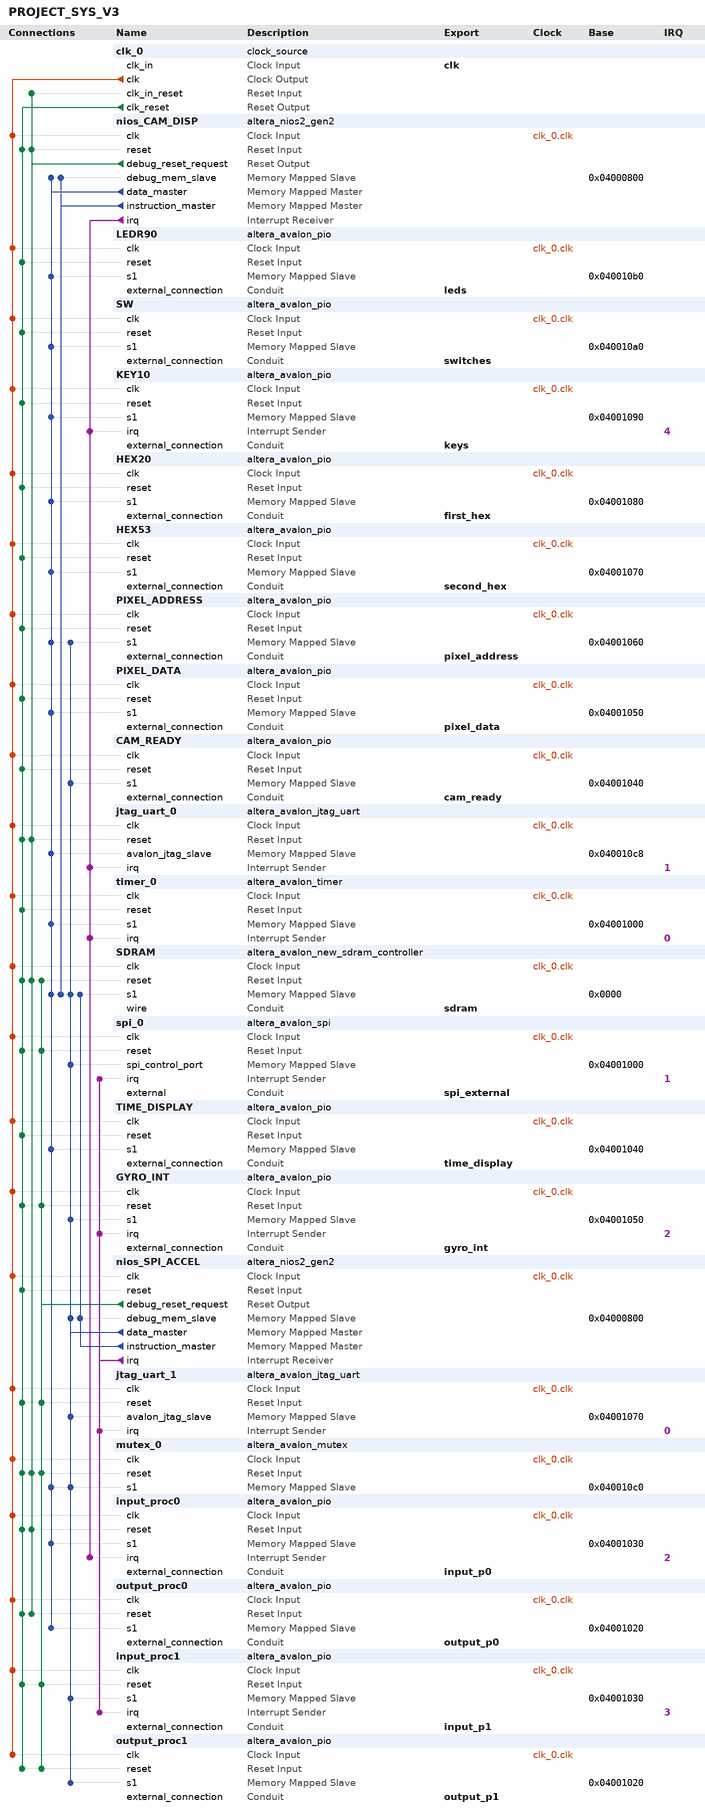
[diagram p0: system contents]
# Platform Designer (Qsys) system PROJECT_SYS_V3, MAX 10 10M50DAF484C7G
# Parameters at their usual value, and those the tool derives, are not listed.
package require -exact qsys 18.1
create_system PROJECT_SYS_V3
set_project_property DEVICE_FAMILY {MAX 10}
set_project_property DEVICE 10M50DAF484C7G

add_instance clk_0 clock_source 18.1
set_instance_parameter_value clk_0 clockFrequency 50000000

add_instance nios_CAM_DISP altera_nios2_gen2 18.1
set_instance_parameter_value nios_CAM_DISP dcache_size 2048
set_instance_parameter_value nios_CAM_DISP exceptionSlave SDRAM.s1
set_instance_parameter_value nios_CAM_DISP icache_size 4096
set_instance_parameter_value nios_CAM_DISP impl Fast
set_instance_parameter_value nios_CAM_DISP resetSlave SDRAM.s1

add_instance LEDR90 altera_avalon_pio 18.1
set_instance_parameter_value LEDR90 direction Output
set_instance_parameter_value LEDR90 width 10

add_instance SW altera_avalon_pio 18.1
set_instance_parameter_value SW direction Input
set_instance_parameter_value SW width 10

add_instance KEY10 altera_avalon_pio 18.1
set_instance_parameter_value KEY10 captureEdge true
set_instance_parameter_value KEY10 direction Input
set_instance_parameter_value KEY10 generateIRQ true
set_instance_parameter_value KEY10 irqType EDGE
set_instance_parameter_value KEY10 width 2

add_instance HEX20 altera_avalon_pio 18.1
set_instance_parameter_value HEX20 direction Output
set_instance_parameter_value HEX20 width 24

add_instance HEX53 altera_avalon_pio 18.1
set_instance_parameter_value HEX53 direction Output
set_instance_parameter_value HEX53 width 24

add_instance PIXEL_ADDRESS altera_avalon_pio 18.1
set_instance_parameter_value PIXEL_ADDRESS direction Output
set_instance_parameter_value PIXEL_ADDRESS width 17

add_instance PIXEL_DATA altera_avalon_pio 18.1
set_instance_parameter_value PIXEL_DATA direction Output
set_instance_parameter_value PIXEL_DATA width 4

add_instance CAM_READY altera_avalon_pio 18.1
set_instance_parameter_value CAM_READY direction Input
set_instance_parameter_value CAM_READY width 1

add_instance jtag_uart_0 altera_avalon_jtag_uart 18.1
set_instance_parameter_value jtag_uart_0 readBufferDepth 256
set_instance_parameter_value jtag_uart_0 simInteractiveOptions NO_INTERACTIVE_WINDOWS
set_instance_parameter_value jtag_uart_0 writeBufferDepth 256

add_instance timer_0 altera_avalon_timer 18.1
set_instance_parameter_value timer_0 period 1
set_instance_parameter_value timer_0 periodUnits MSEC

add_instance SDRAM altera_avalon_new_sdram_controller 18.1
set_instance_parameter_value SDRAM TAC 5.5
set_instance_parameter_value SDRAM TRCD 20.0
set_instance_parameter_value SDRAM TRP 20.0
set_instance_parameter_value SDRAM casLatency 3
set_instance_parameter_value SDRAM columnWidth 10
set_instance_parameter_value SDRAM dataWidth 16
set_instance_parameter_value SDRAM generateSimulationModel false
set_instance_parameter_value SDRAM model single_Micron_MT48LC4M32B2_7_chip
set_instance_parameter_value SDRAM numberOfBanks 4
set_instance_parameter_value SDRAM numberOfChipSelects 1
set_instance_parameter_value SDRAM powerUpDelay 100.0
set_instance_parameter_value SDRAM refreshPeriod 15.625
set_instance_parameter_value SDRAM rowWidth 13

add_instance spi_0 altera_avalon_spi 18.1
set_instance_parameter_value spi_0 clockPhase 1
set_instance_parameter_value spi_0 clockPolarity 1
set_instance_parameter_value spi_0 dataWidth 8
set_instance_parameter_value spi_0 masterSPI true
set_instance_parameter_value spi_0 numberOfSlaves 2
set_instance_parameter_value spi_0 targetClockRate 5000000

add_instance TIME_DISPLAY altera_avalon_pio 18.1
set_instance_parameter_value TIME_DISPLAY direction Input
set_instance_parameter_value TIME_DISPLAY width 32

add_instance GYRO_INT altera_avalon_pio 18.1
set_instance_parameter_value GYRO_INT captureEdge true
set_instance_parameter_value GYRO_INT direction Input
set_instance_parameter_value GYRO_INT generateIRQ true
set_instance_parameter_value GYRO_INT irqType EDGE
set_instance_parameter_value GYRO_INT width 1

add_instance nios_SPI_ACCEL altera_nios2_gen2 18.1
set_instance_parameter_value nios_SPI_ACCEL cpuID 1
set_instance_parameter_value nios_SPI_ACCEL dcache_size 2048
set_instance_parameter_value nios_SPI_ACCEL exceptionSlave SDRAM.s1
set_instance_parameter_value nios_SPI_ACCEL icache_size 4096
set_instance_parameter_value nios_SPI_ACCEL impl Fast
set_instance_parameter_value nios_SPI_ACCEL resetSlave SDRAM.s1

add_instance jtag_uart_1 altera_avalon_jtag_uart 18.1
set_instance_parameter_value jtag_uart_1 simInteractiveOptions NO_INTERACTIVE_WINDOWS

add_instance mutex_0 altera_avalon_mutex 18.1

add_instance input_proc0 altera_avalon_pio 18.1
set_instance_parameter_value input_proc0 bitClearingEdgeCapReg true
set_instance_parameter_value input_proc0 captureEdge true
set_instance_parameter_value input_proc0 direction Input
set_instance_parameter_value input_proc0 generateIRQ true
set_instance_parameter_value input_proc0 irqType EDGE
set_instance_parameter_value input_proc0 width 1

add_instance output_proc0 altera_avalon_pio 18.1
set_instance_parameter_value output_proc0 direction Output
set_instance_parameter_value output_proc0 width 1

add_instance input_proc1 altera_avalon_pio 18.1
set_instance_parameter_value input_proc1 bitClearingEdgeCapReg true
set_instance_parameter_value input_proc1 captureEdge true
set_instance_parameter_value input_proc1 direction Input
set_instance_parameter_value input_proc1 generateIRQ true
set_instance_parameter_value input_proc1 irqType EDGE
set_instance_parameter_value input_proc1 width 1

add_instance output_proc1 altera_avalon_pio 18.1
set_instance_parameter_value output_proc1 direction Output
set_instance_parameter_value output_proc1 width 1

# connections
add_connection clk_0.clk CAM_READY.clk clock
add_connection clk_0.clk GYRO_INT.clk clock
add_connection clk_0.clk HEX20.clk clock
add_connection clk_0.clk HEX53.clk clock
add_connection clk_0.clk input_proc0.clk clock
add_connection clk_0.clk input_proc1.clk clock
add_connection clk_0.clk jtag_uart_0.clk clock
add_connection clk_0.clk jtag_uart_1.clk clock
add_connection clk_0.clk KEY10.clk clock
add_connection clk_0.clk LEDR90.clk clock
add_connection clk_0.clk mutex_0.clk clock
add_connection clk_0.clk nios_CAM_DISP.clk clock
add_connection clk_0.clk nios_SPI_ACCEL.clk clock
add_connection clk_0.clk output_proc0.clk clock
add_connection clk_0.clk output_proc1.clk clock
add_connection clk_0.clk PIXEL_ADDRESS.clk clock
add_connection clk_0.clk PIXEL_DATA.clk clock
add_connection clk_0.clk SDRAM.clk clock
add_connection clk_0.clk spi_0.clk clock
add_connection clk_0.clk SW.clk clock
add_connection clk_0.clk TIME_DISPLAY.clk clock
add_connection clk_0.clk timer_0.clk clock
add_connection clk_0.clk_reset CAM_READY.reset reset
add_connection clk_0.clk_reset GYRO_INT.reset reset
add_connection clk_0.clk_reset HEX20.reset reset
add_connection clk_0.clk_reset HEX53.reset reset
add_connection clk_0.clk_reset input_proc0.reset reset
add_connection clk_0.clk_reset input_proc1.reset reset
add_connection clk_0.clk_reset jtag_uart_0.reset reset
add_connection clk_0.clk_reset jtag_uart_1.reset reset
add_connection clk_0.clk_reset KEY10.reset reset
add_connection clk_0.clk_reset LEDR90.reset reset
add_connection clk_0.clk_reset mutex_0.reset reset
add_connection clk_0.clk_reset nios_CAM_DISP.reset reset
add_connection clk_0.clk_reset nios_SPI_ACCEL.reset reset
add_connection clk_0.clk_reset output_proc0.reset reset
add_connection clk_0.clk_reset output_proc1.reset reset
add_connection clk_0.clk_reset PIXEL_ADDRESS.reset reset
add_connection clk_0.clk_reset PIXEL_DATA.reset reset
add_connection clk_0.clk_reset SDRAM.reset reset
add_connection clk_0.clk_reset spi_0.reset reset
add_connection clk_0.clk_reset SW.reset reset
add_connection clk_0.clk_reset TIME_DISPLAY.reset reset
add_connection clk_0.clk_reset timer_0.reset reset
add_connection nios_CAM_DISP.debug_reset_request clk_0.clk_in_reset reset
add_connection nios_CAM_DISP.debug_reset_request input_proc0.reset reset
add_connection nios_CAM_DISP.debug_reset_request jtag_uart_0.reset reset
add_connection nios_CAM_DISP.debug_reset_request mutex_0.reset reset
add_connection nios_CAM_DISP.debug_reset_request nios_CAM_DISP.reset reset
add_connection nios_CAM_DISP.debug_reset_request output_proc0.reset reset
add_connection nios_CAM_DISP.debug_reset_request SDRAM.reset reset
add_connection nios_SPI_ACCEL.debug_reset_request GYRO_INT.reset reset
add_connection nios_SPI_ACCEL.debug_reset_request input_proc1.reset reset
add_connection nios_SPI_ACCEL.debug_reset_request jtag_uart_1.reset reset
add_connection nios_SPI_ACCEL.debug_reset_request mutex_0.reset reset
add_connection nios_SPI_ACCEL.debug_reset_request output_proc1.reset reset
add_connection nios_SPI_ACCEL.debug_reset_request SDRAM.reset reset
add_connection nios_SPI_ACCEL.debug_reset_request spi_0.reset reset
add_connection nios_CAM_DISP.data_master HEX20.s1 avalon
set_connection_parameter_value nios_CAM_DISP.data_master/HEX20.s1 baseAddress 0x04001080
add_connection nios_CAM_DISP.data_master HEX53.s1 avalon
set_connection_parameter_value nios_CAM_DISP.data_master/HEX53.s1 baseAddress 0x04001070
add_connection nios_CAM_DISP.data_master input_proc0.s1 avalon
set_connection_parameter_value nios_CAM_DISP.data_master/input_proc0.s1 baseAddress 0x04001030
add_connection nios_CAM_DISP.data_master jtag_uart_0.avalon_jtag_slave avalon
set_connection_parameter_value nios_CAM_DISP.data_master/jtag_uart_0.avalon_jtag_slave baseAddress 0x040010c8
add_connection nios_CAM_DISP.data_master KEY10.s1 avalon
set_connection_parameter_value nios_CAM_DISP.data_master/KEY10.s1 baseAddress 0x04001090
add_connection nios_CAM_DISP.data_master LEDR90.s1 avalon
set_connection_parameter_value nios_CAM_DISP.data_master/LEDR90.s1 baseAddress 0x040010b0
add_connection nios_CAM_DISP.data_master mutex_0.s1 avalon
set_connection_parameter_value nios_CAM_DISP.data_master/mutex_0.s1 baseAddress 0x040010c0
add_connection nios_CAM_DISP.data_master nios_CAM_DISP.debug_mem_slave avalon
set_connection_parameter_value nios_CAM_DISP.data_master/nios_CAM_DISP.debug_mem_slave baseAddress 0x04000800
add_connection nios_CAM_DISP.data_master output_proc0.s1 avalon
set_connection_parameter_value nios_CAM_DISP.data_master/output_proc0.s1 baseAddress 0x04001020
add_connection nios_CAM_DISP.data_master PIXEL_ADDRESS.s1 avalon
set_connection_parameter_value nios_CAM_DISP.data_master/PIXEL_ADDRESS.s1 baseAddress 0x04001060
add_connection nios_CAM_DISP.data_master PIXEL_DATA.s1 avalon
set_connection_parameter_value nios_CAM_DISP.data_master/PIXEL_DATA.s1 baseAddress 0x04001050
add_connection nios_CAM_DISP.data_master SDRAM.s1 avalon
set_connection_parameter_value nios_CAM_DISP.data_master/SDRAM.s1 baseAddress 0x0000
add_connection nios_CAM_DISP.data_master SW.s1 avalon
set_connection_parameter_value nios_CAM_DISP.data_master/SW.s1 baseAddress 0x040010a0
add_connection nios_CAM_DISP.data_master TIME_DISPLAY.s1 avalon
set_connection_parameter_value nios_CAM_DISP.data_master/TIME_DISPLAY.s1 baseAddress 0x04001040
add_connection nios_CAM_DISP.data_master timer_0.s1 avalon
set_connection_parameter_value nios_CAM_DISP.data_master/timer_0.s1 baseAddress 0x04001000
add_connection nios_CAM_DISP.instruction_master nios_CAM_DISP.debug_mem_slave avalon
set_connection_parameter_value nios_CAM_DISP.instruction_master/nios_CAM_DISP.debug_mem_slave baseAddress 0x04000800
add_connection nios_CAM_DISP.instruction_master SDRAM.s1 avalon
set_connection_parameter_value nios_CAM_DISP.instruction_master/SDRAM.s1 baseAddress 0x0000
add_connection nios_SPI_ACCEL.data_master CAM_READY.s1 avalon
set_connection_parameter_value nios_SPI_ACCEL.data_master/CAM_READY.s1 baseAddress 0x04001040
add_connection nios_SPI_ACCEL.data_master GYRO_INT.s1 avalon
set_connection_parameter_value nios_SPI_ACCEL.data_master/GYRO_INT.s1 baseAddress 0x04001050
add_connection nios_SPI_ACCEL.data_master input_proc1.s1 avalon
set_connection_parameter_value nios_SPI_ACCEL.data_master/input_proc1.s1 baseAddress 0x04001030
add_connection nios_SPI_ACCEL.data_master jtag_uart_1.avalon_jtag_slave avalon
set_connection_parameter_value nios_SPI_ACCEL.data_master/jtag_uart_1.avalon_jtag_slave baseAddress 0x04001070
add_connection nios_SPI_ACCEL.data_master mutex_0.s1 avalon
set_connection_parameter_value nios_SPI_ACCEL.data_master/mutex_0.s1 baseAddress 0x040010c0
add_connection nios_SPI_ACCEL.data_master nios_SPI_ACCEL.debug_mem_slave avalon
set_connection_parameter_value nios_SPI_ACCEL.data_master/nios_SPI_ACCEL.debug_mem_slave baseAddress 0x04000800
add_connection nios_SPI_ACCEL.data_master output_proc1.s1 avalon
set_connection_parameter_value nios_SPI_ACCEL.data_master/output_proc1.s1 baseAddress 0x04001020
add_connection nios_SPI_ACCEL.data_master PIXEL_ADDRESS.s1 avalon
set_connection_parameter_value nios_SPI_ACCEL.data_master/PIXEL_ADDRESS.s1 baseAddress 0x04001060
add_connection nios_SPI_ACCEL.data_master SDRAM.s1 avalon
set_connection_parameter_value nios_SPI_ACCEL.data_master/SDRAM.s1 baseAddress 0x0000
add_connection nios_SPI_ACCEL.data_master spi_0.spi_control_port avalon
set_connection_parameter_value nios_SPI_ACCEL.data_master/spi_0.spi_control_port baseAddress 0x04001000
add_connection nios_SPI_ACCEL.instruction_master nios_SPI_ACCEL.debug_mem_slave avalon
set_connection_parameter_value nios_SPI_ACCEL.instruction_master/nios_SPI_ACCEL.debug_mem_slave baseAddress 0x04000800
add_connection nios_SPI_ACCEL.instruction_master SDRAM.s1 avalon
set_connection_parameter_value nios_SPI_ACCEL.instruction_master/SDRAM.s1 baseAddress 0x0000
add_connection nios_CAM_DISP.irq input_proc0.irq interrupt
set_connection_parameter_value nios_CAM_DISP.irq/input_proc0.irq irqNumber 2
add_connection nios_CAM_DISP.irq jtag_uart_0.irq interrupt
set_connection_parameter_value nios_CAM_DISP.irq/jtag_uart_0.irq irqNumber 1
add_connection nios_CAM_DISP.irq KEY10.irq interrupt
set_connection_parameter_value nios_CAM_DISP.irq/KEY10.irq irqNumber 4
add_connection nios_CAM_DISP.irq timer_0.irq interrupt
set_connection_parameter_value nios_CAM_DISP.irq/timer_0.irq irqNumber 0
add_connection nios_SPI_ACCEL.irq GYRO_INT.irq interrupt
set_connection_parameter_value nios_SPI_ACCEL.irq/GYRO_INT.irq irqNumber 2
add_connection nios_SPI_ACCEL.irq input_proc1.irq interrupt
set_connection_parameter_value nios_SPI_ACCEL.irq/input_proc1.irq irqNumber 3
add_connection nios_SPI_ACCEL.irq jtag_uart_1.irq interrupt
set_connection_parameter_value nios_SPI_ACCEL.irq/jtag_uart_1.irq irqNumber 0
add_connection nios_SPI_ACCEL.irq spi_0.irq interrupt
set_connection_parameter_value nios_SPI_ACCEL.irq/spi_0.irq irqNumber 1

# exported interfaces
add_interface cam_ready conduit end
set_interface_property cam_ready EXPORT_OF CAM_READY.external_connection
add_interface clk clock sink
set_interface_property clk EXPORT_OF clk_0.clk_in
add_interface first_hex conduit end
set_interface_property first_hex EXPORT_OF HEX20.external_connection
add_interface gyro_int conduit end
set_interface_property gyro_int EXPORT_OF GYRO_INT.external_connection
add_interface input_p0 conduit end
set_interface_property input_p0 EXPORT_OF input_proc0.external_connection
add_interface input_p1 conduit end
set_interface_property input_p1 EXPORT_OF input_proc1.external_connection
add_interface keys conduit end
set_interface_property keys EXPORT_OF KEY10.external_connection
add_interface leds conduit end
set_interface_property leds EXPORT_OF LEDR90.external_connection
add_interface output_p0 conduit end
set_interface_property output_p0 EXPORT_OF output_proc0.external_connection
add_interface output_p1 conduit end
set_interface_property output_p1 EXPORT_OF output_proc1.external_connection
add_interface pixel_address conduit end
set_interface_property pixel_address EXPORT_OF PIXEL_ADDRESS.external_connection
add_interface pixel_data conduit end
set_interface_property pixel_data EXPORT_OF PIXEL_DATA.external_connection
add_interface sdram conduit end
set_interface_property sdram EXPORT_OF SDRAM.wire
add_interface second_hex conduit end
set_interface_property second_hex EXPORT_OF HEX53.external_connection
add_interface spi_external conduit end
set_interface_property spi_external EXPORT_OF spi_0.external
add_interface switches conduit end
set_interface_property switches EXPORT_OF SW.external_connection
add_interface time_display conduit end
set_interface_property time_display EXPORT_OF TIME_DISPLAY.external_connection

set_interconnect_requirement {$system} qsys_mm.clockCrossingAdapter HANDSHAKE
set_interconnect_requirement {$system} qsys_mm.enableEccProtection FALSE
set_interconnect_requirement {$system} qsys_mm.insertDefaultSlave FALSE
set_interconnect_requirement {$system} qsys_mm.maxAdditionalLatency 1

save_system PROJECT_SYS_V3.qsys
